# EAGLE schematic key (EAGLE 7.7.0)
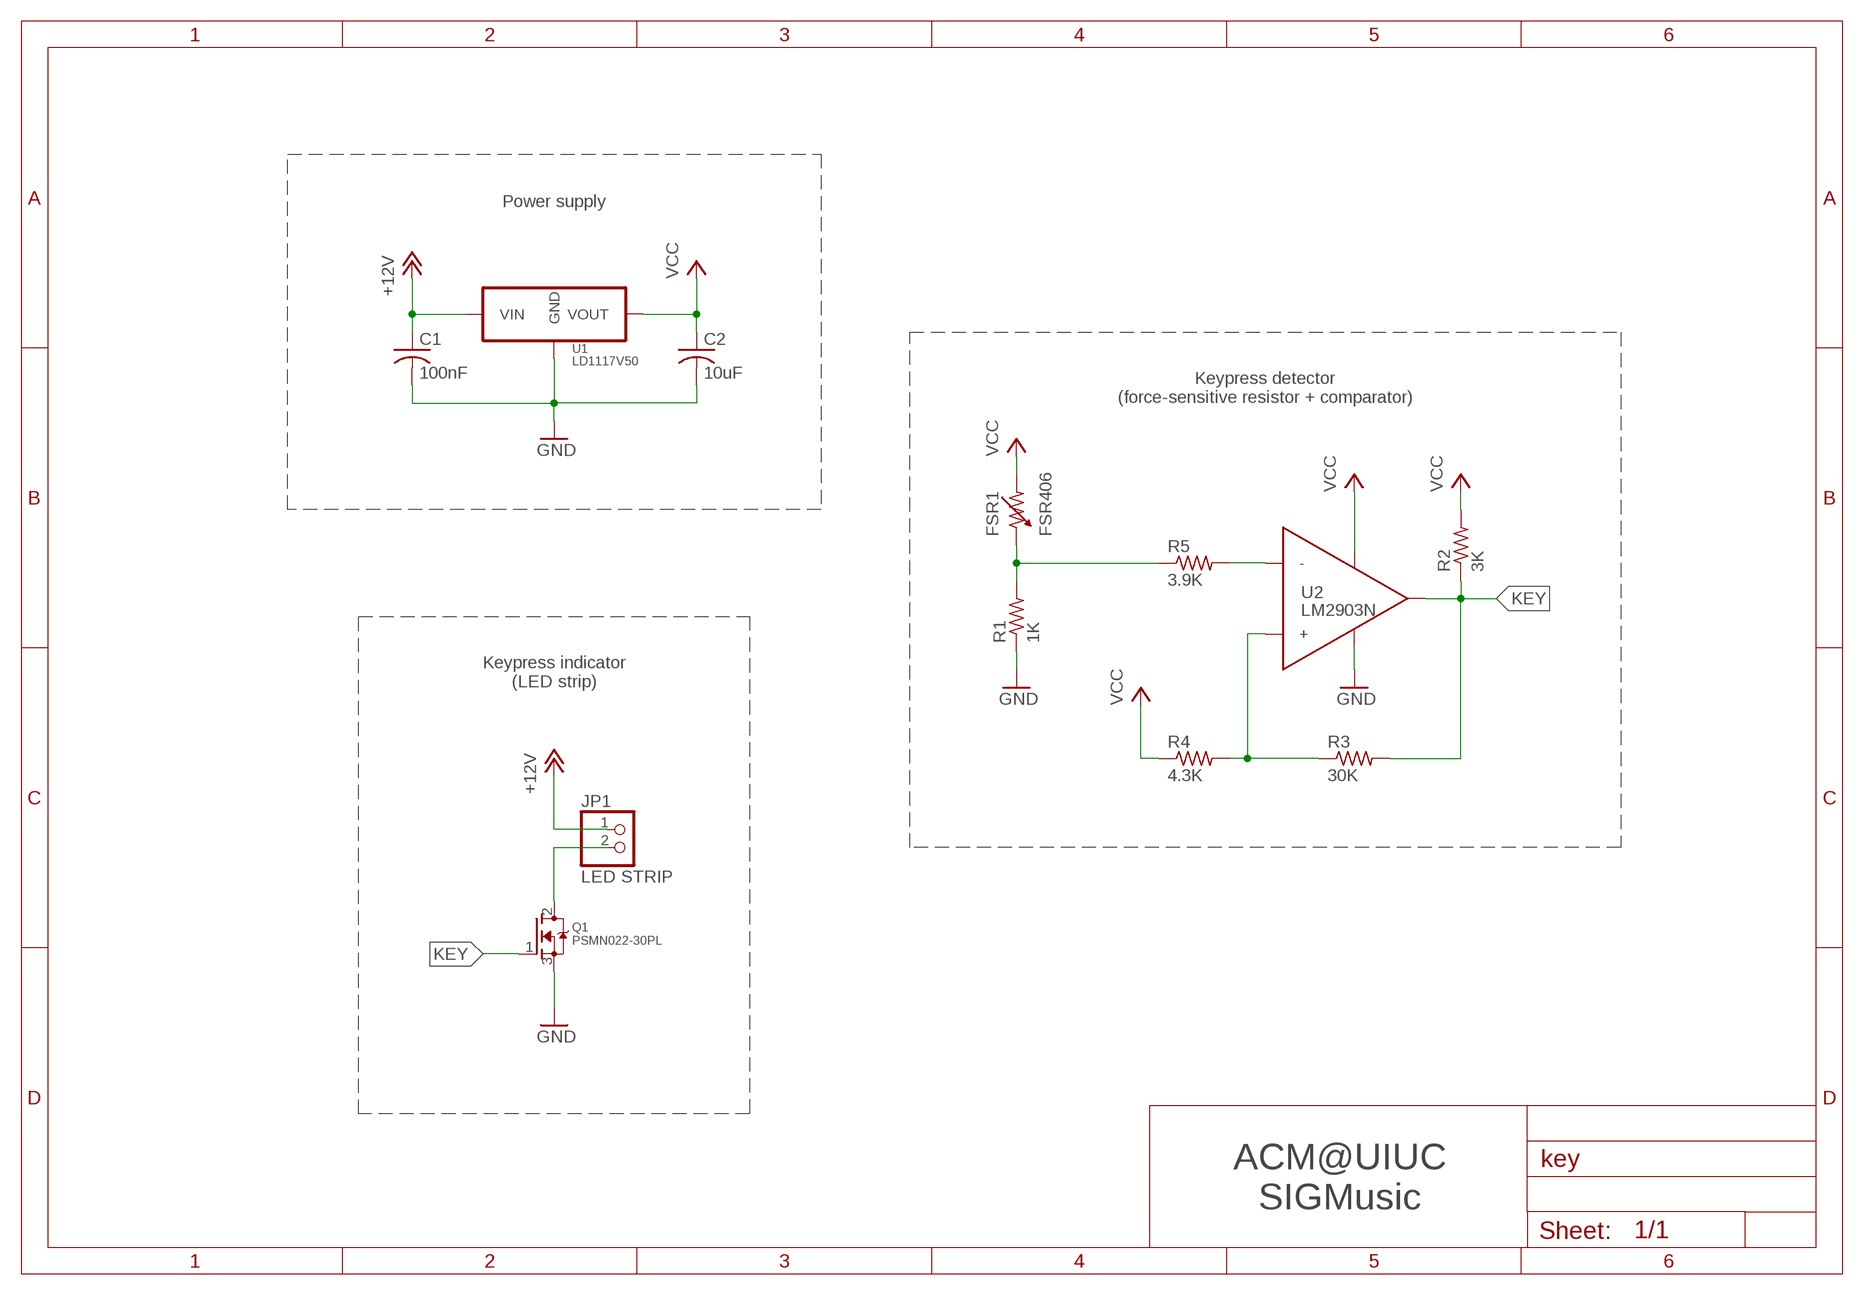
[diagram p0: schematic, sheet 1]

## Parts
C1  100nF  C-US025-025X050  [C025-025X050]
C2  10uF  C-US025-025X050  [C025-025X050]
FSR1  FSR406  FSR-SQUARE  [FSR-SQUARE]
JP1  LED STRIP  PINHD-1X2/90  [1X02/90]
Q1  PSMN022-30PL  MOSFET-NGDS_TO220V  [TO220V]
R1  1K  R-US_0207/10  [0207/10]
R2  3K  R-US_0207/10  [0207/10]
R3  30K  R-US_0207/10  [0207/10]
R4  4.3K  R-US_0207/10  [0207/10]
R5  3.9K  R-US_0207/10  [0207/10]
U1  LD1117V50  LD1117  [TO-220]
U2  LM2903N  LM2903P  [DIL08]

## Nets
+12V: C1.1 JP1.1 U1.P$3(VIN)
FORCE: FSR1.P$1 R1.2 R5.1
GND: C1.2 C2.2 Q1.3(S) R1.1 U1.P$1(GND) U2.4(GND) U2.5(GND) U2.6(GND) U2.7(GND)
KEY: Q1.1(G) R2.1 R3.2 U2.1
N$2: JP1.2 Q1.2(D)
N$3: R3.1 R4.2 U2.3(+)
N$4: R5.2 U2.2(-)
VCC: C2.1 FSR1.P$2 R2.2 R4.1 U1.P$2(VOUT) U1.P$4(VOUT) U2.8(VCC)

## Notes on the sheet
- Power supply
- Keypress detector
  (force-sensitive resistor + comparator)
- Keypress indicator
  (LED strip)
- ACM@UIUC
  SIGMusic

## Library data of the parts
C1 C2 = rcl:C-US: CAPACITOR, American symbol
FSR1 = my-custom:FSR-SQUARE
JP1 = pinhead:PINHD-1X2: PIN HEADER
Q1 = adafruit:MOSFET-N: N-Channel Mosfet 2N7002E - 60V 260mA SOT23 [Digikey: 2N7002ET1GOSTR-ND] - REEL BSH103 - 30V 850mA SOT23 [Digikey: 568-5013-1-ND]
R1-R5 = rcl:R-US_: RESISTOR, American symbol
U1 = my-custom:LD1117
U2 = my-custom:LM2903P